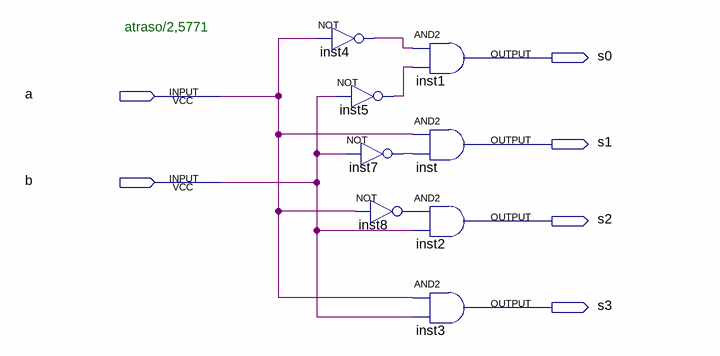
[diagram p0: schematic sheet]
// Quartus schematic DECODER2x4.bdf as structural Verilog: 8 symbols, 6 pins
module DECODER2x4 (
  input  a,
  input  b,
  output s0,
  output s1,
  output s2,
  output s3
);

  wire inst4_out, inst5_out, inst7_out, inst8_out;

  not inst4 (inst4_out, a);
  not inst5 (inst5_out, b);
  not inst7 (inst7_out, b);
  not inst8 (inst8_out, a);
  and inst1 (s0, inst4_out, inst5_out);
  and inst (s1, a, inst7_out);
  and inst2 (s2, inst8_out, b);
  and inst3 (s3, a, b);

  // Notes on the sheet:
  //   atraso/2,5771
endmodule
